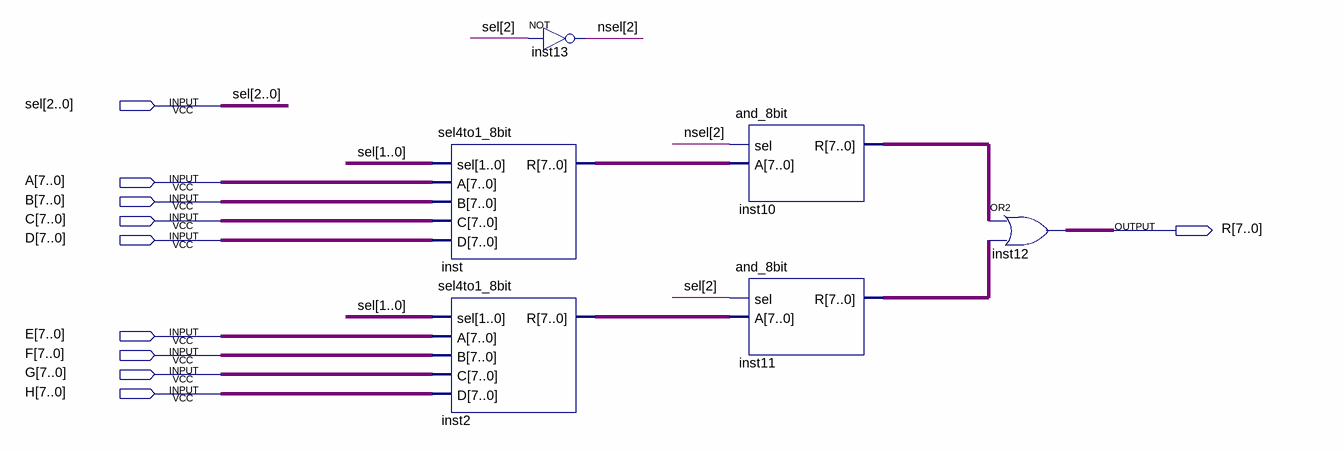
[diagram p0: schematic sheet]
// Quartus schematic sel8to1_8bit.bdf as structural Verilog: 6 symbols, 10 pins
module sel8to1_8bit (
  input  [2:0] sel,
  input  [7:0] A,
  input  [7:0] B,
  input  [7:0] C,
  input  [7:0] D,
  input  [7:0] E,
  input  [7:0] F,
  input  [7:0] G,
  input  [7:0] H,
  output [7:0] R
);

  wire [2:2] nsel;
  wire [7:0] inst2_r, inst10_r, inst11_r, inst_r;

  sel4to1_8bit inst (.sel(sel[1:0]), .A(A), .B(B), .C(C), .D(D), .R(inst_r));
  sel4to1_8bit inst2 (.sel(sel[1:0]), .A(E), .B(F), .C(G), .D(H), .R(inst2_r));
  not inst13 (nsel[2], sel[2]);
  and_8bit inst10 (.sel(nsel[2]), .A(inst_r), .R(inst10_r));
  and_8bit inst11 (.sel(sel[2]), .A(inst2_r), .R(inst11_r));
  assign R = inst10_r | inst11_r;  // OR2 inst12, 8 bits wide
endmodule
